# Altium schematic sheet PART11_Rectifier.SchDoc
size A4
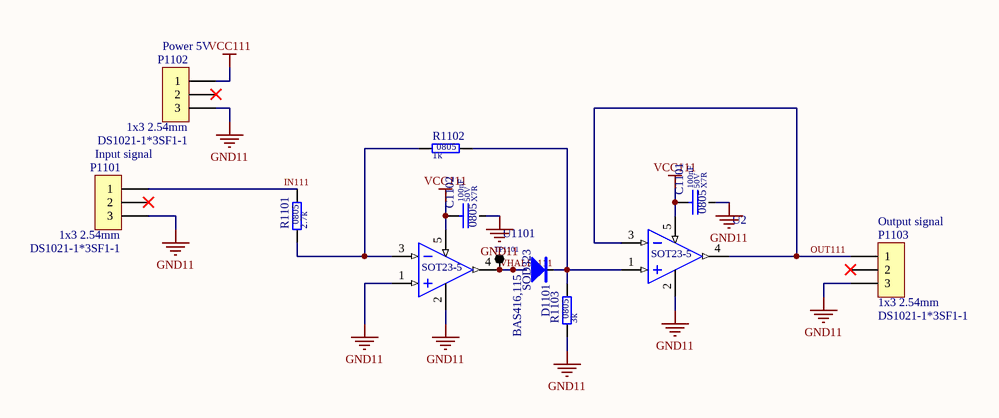
[diagram p0: PART11_Rectifier.SchDoc]

## Parts
C1101  value 100nF  Dielectric: X7R  Voltage: 50V  SCH_Footprint: 0805  [C_0805_2012]  (hidden comment: Ceramic X7R)
C1102  value 100nF  Dielectric: X7R  Voltage: 50V  SCH_Footprint: 0805  [C_0805_2012]  (hidden comment: Ceramic X7R)
D1101  value BAS416,115  [SOD323]  (hidden comment: BAS416)
P1101  Input signal  value DS1021-1*3SF1-1  SCH_Footprint: 1x3 2.54mm  [P_HEADER_1x3_2.54]
P1102  Power 5V  value DS1021-1*3SF1-1  SCH_Footprint: 1x3 2.54mm  [P_HEADER_1x3_2.54]
P1103  Output signal  value DS1021-1*3SF1-1  SCH_Footprint: 1x3 2.54mm  [P_HEADER_1x3_2.54]
R1101  value 2.7k  SCH_Footprint: 0805  [R_0805_2012]  (hidden comment: Resistor)
R1102  value 1k  SCH_Footprint: 0805  [R_0805_2012]  (hidden comment: Resistor)
R1103  value 3k  SCH_Footprint: 0805  [R_0805_2012]  (hidden comment: Resistor)
TP1101  Single pin  [TP_1PIN]  (value not drawn)
U2  SCH_Footprint: SOT23-5  [SOT23-5_SC74A_SOT753_M]  (hidden comment: LM321)
U1101  SCH_Footprint: SOT23-5  [SOT23-5_SC74A_SOT753_M]  (hidden comment: LM321)

## Nets
GND11: C1101.2 C1102.2 P1101.3 P1102.3 P1103.3 R1103.1 U2.2(GND) U1101.1(IN+) U1101.2(GND)
VCC111: C1101.1 C1102.1 P1102.1 U2.5(VDD) U1101.5(VDD)
IN111: P1101.1 R1101.2
OUT111: P1103.1 U2.3(IN-) U2.4(OUT)
VHALF_111: D1101.2 TP1101.1(TP) U1101.4(OUT)
NetD1101_1: D1101.1 R1102.2 R1103.2 U2.1(IN+)
NetR1101_1: R1101.1 R1102.1 U1101.3(IN-)

Not connected (* = marked no-connect by the designer): P1101 2*; P1102 2*; P1103 2*

## Library data of the parts
C1101 C1102 = C_100nF_50V_X7R_0805_10: Capacitor; Manufacturer: AVX; Manufacturer Part Number: 08055C104K4T2A; Tolerance (%): 10; Part Number: C_100nF_50V_X7R_0805_10; HelpURL: http://www.tme.eu/pl/Document/943bdb20b23b898c4d4b2ec4eca4f2b6/cauto.pdf; Supplier 1: TME; Supplier Part Number 1: 08055C104K4T2A; Supplier 2: RS Components; Supplier 3: Farnell; Supplier 4: Mouser; Supplier 5: Digi-Key
D1101 = D_BAS416_0A5_75V_SOD323: Manufacturer: Nexperia; Voltage: 75V; Current: 0.5A; SCH_Footprint: SOD323; Part Number: D_BAS416_0A5_75V_SOD323; HelpURL: https://assets.nexperia.com/documents/data-sheet/BAS416.pdf; Manufacturer Part Number: BAS416,115; Supplier 1: TME; Supplier Part Number 1: BAS416.115; Supplier 2: RS Components; Supplier Part Number 2: 508-286; Supplier 3: Farnell; Supplier Part Number 3: 2319285; Supplier 4: Mouser; Supplier Part Number 4: 771-BAS416-T/R; Supplier 5: Digi-Key; Supplier Part Number 5: 1727-4807-1-ND
P1101-P1103 = P_HEADER_1x3_2.54: Pin Header; Manufacturer: Connfly; Part Number: P_HEADER_1x3_2.54; Component Type: Standard; HelpURL: http://www.tme.eu/en/Document/cc301e58a5da78cb543a94b5a5b7f06a/DS1021.pdf; Manufacturer Part Number: DS1021-1*3SF1-1; Supplier 1: TME; Supplier Part Number 1: ZL201-03G; Supplier 2: RS Components; Supplier 3: Farnell; Supplier 4: Mouser; Supplier 5: Digi-Key
R1101 = R_2.7k_0805_1: Manufacturer: Royalohm; Manufacturer Part Number: HP05W3F2701T5E; Voltage: 150V; Power: 300mW; Tolerance: 1%; Part Number: R_2.7k_0805_1; HelpURL: https://www.tme.eu/pl/Document/fa390a0a31e891a154d3713216995c6e/HighPowerHP.pdf; Supplier 1: TME; Supplier Part Number 1: HP05-2K71%; Supplier 2: RS Components; Supplier 3: Farnell; Supplier 4: Mouser; Supplier 5: Digi-Key
R1102 = R_1k_0805_1: Manufacturer: Royalohm; Manufacturer Part Number: HP05W3F1001T5E; Voltage: 150V; Power: 300mW; Tolerance: 1%; Part Number: R_1k_0805_1; HelpURL: https://www.tme.eu/pl/Document/63d5a2fbb689d2d511047d7cc8640cd8/chip_resistor_hp.pdf; Supplier 1: TME; Supplier Part Number 1: HP05-1K1%; Supplier 2: RS Components; Supplier 3: Farnell; Supplier 4: Mouser; Supplier 5: Digi-Key
R1103 = R_3k_0805_1: Manufacturer: Royalohm; Manufacturer Part Number: HP05W3F3001T5E; Voltage: 150V; Power: 300mW; Tolerance: 1%; Part Number: R_3k_0805_1; HelpURL: https://www.tme.eu/pl/Document/fa390a0a31e891a154d3713216995c6e/HighPowerHP.pdf; Supplier 1: TME; Supplier Part Number 1: HP05-3K1%; Supplier 2: RS Components; Supplier 3: Farnell; Supplier 4: Mouser; Supplier 5: Digi-Key
TP1101 = TP_1PIN: Testpoint; SCH_Footprint: Single; Part Number: TP_1PIN; Component Type: Standard; Supplier 1: TME; Supplier 2: RS Components; Supplier 3: Farnell; Supplier 4: Mouser; Supplier 5: Digi-Key
U2 U1101 = A_LM321: Part Number: A_LM321; HelpURL: http://www.ti.com/lit/ds/symlink/lm321.pdf; Supplier 1: TME; Supplier 2: RS Components; Supplier 3: Farnell; Supplier 4: Mouser; Supplier Part Number 4: 926-LM321MFX/NOPB; Supplier 5: Digi-Key; Supplier Part Number 5: LM321MF/NOPBCT-ND